# Altium schematic sheet 锐米 LoRaWAN Gateway 原理图.SchDoc
size A2
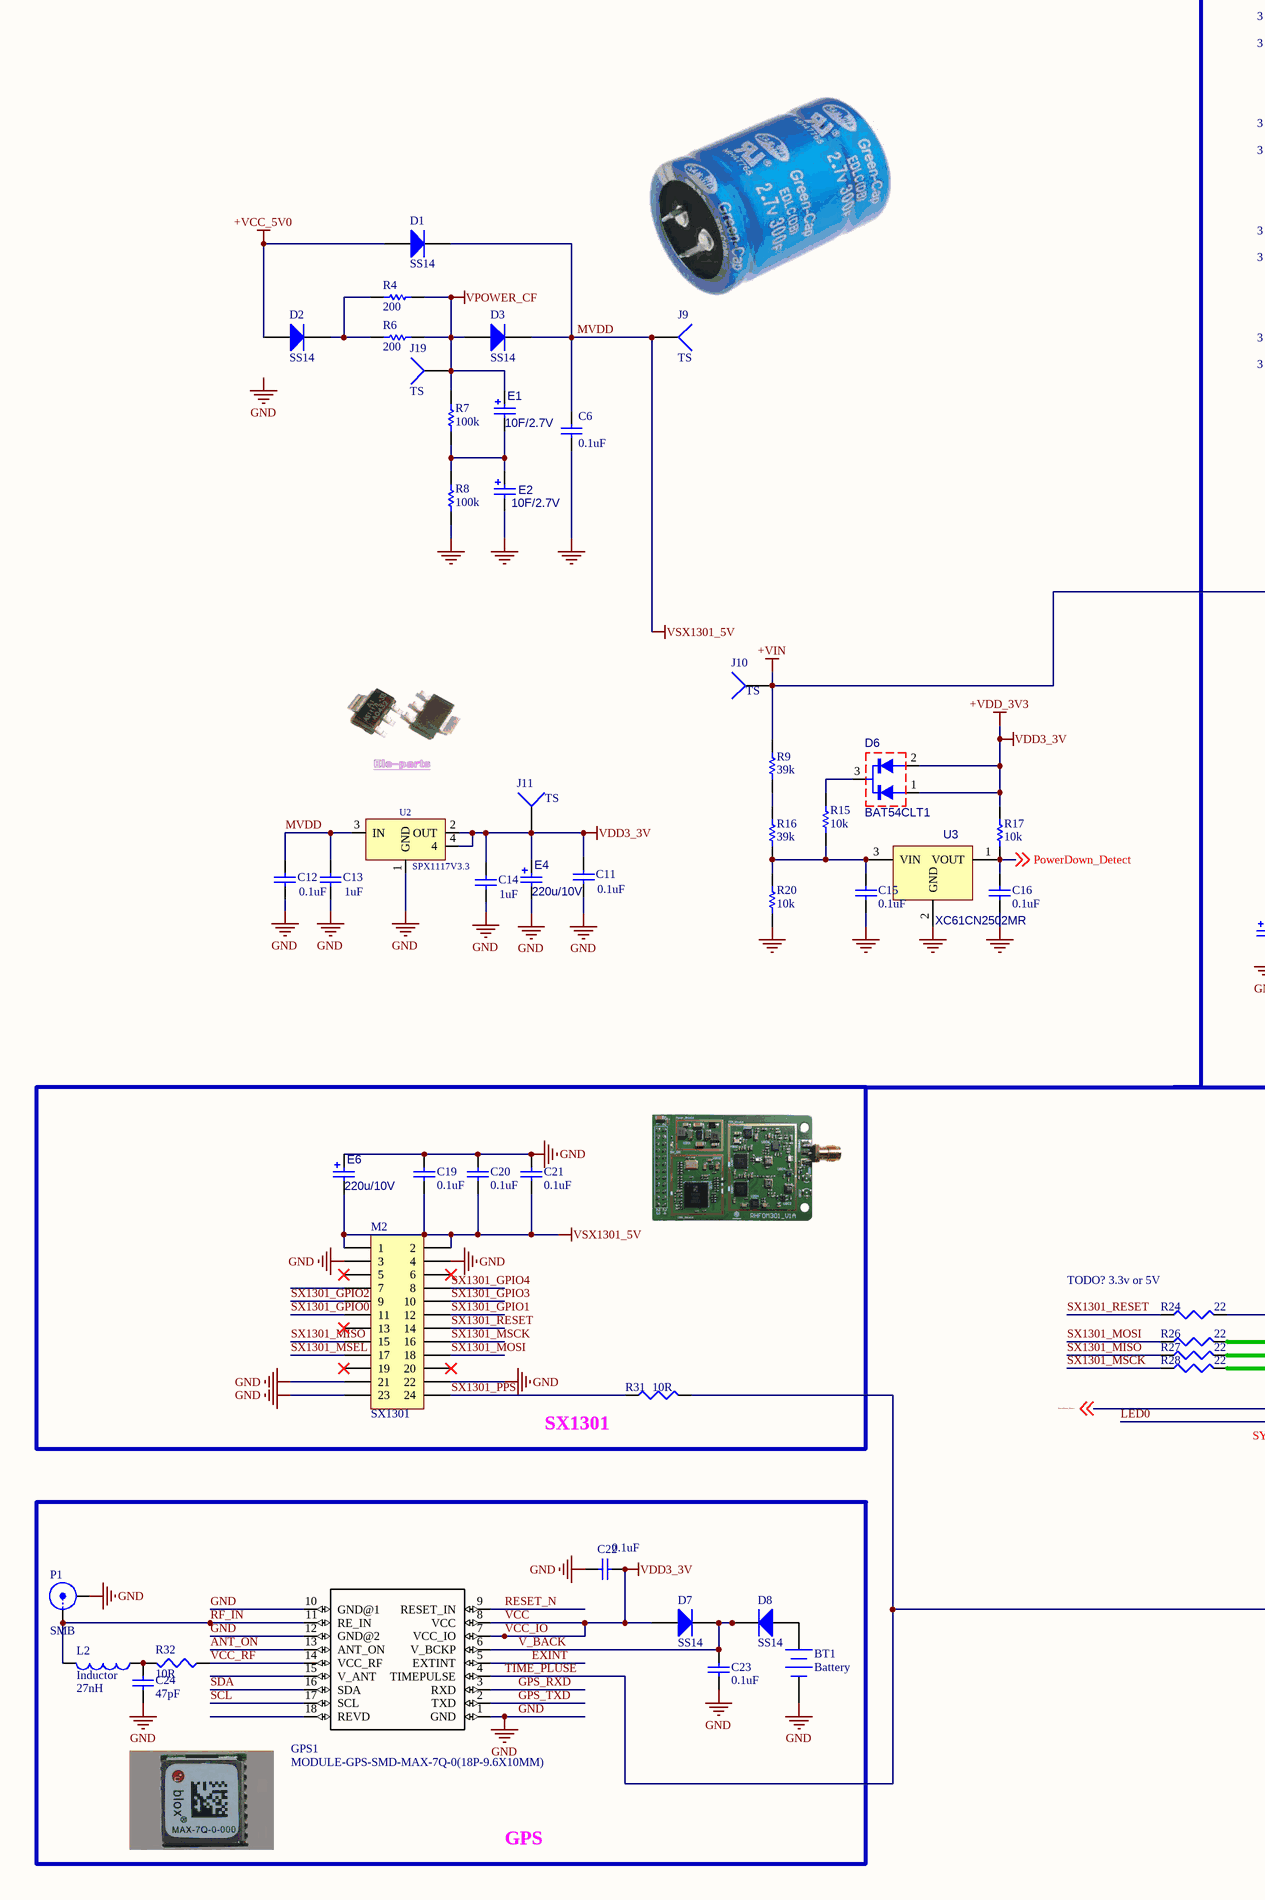
[diagram p0: 锐米 LoRaWAN Gateway 原理图.SchDoc, left]
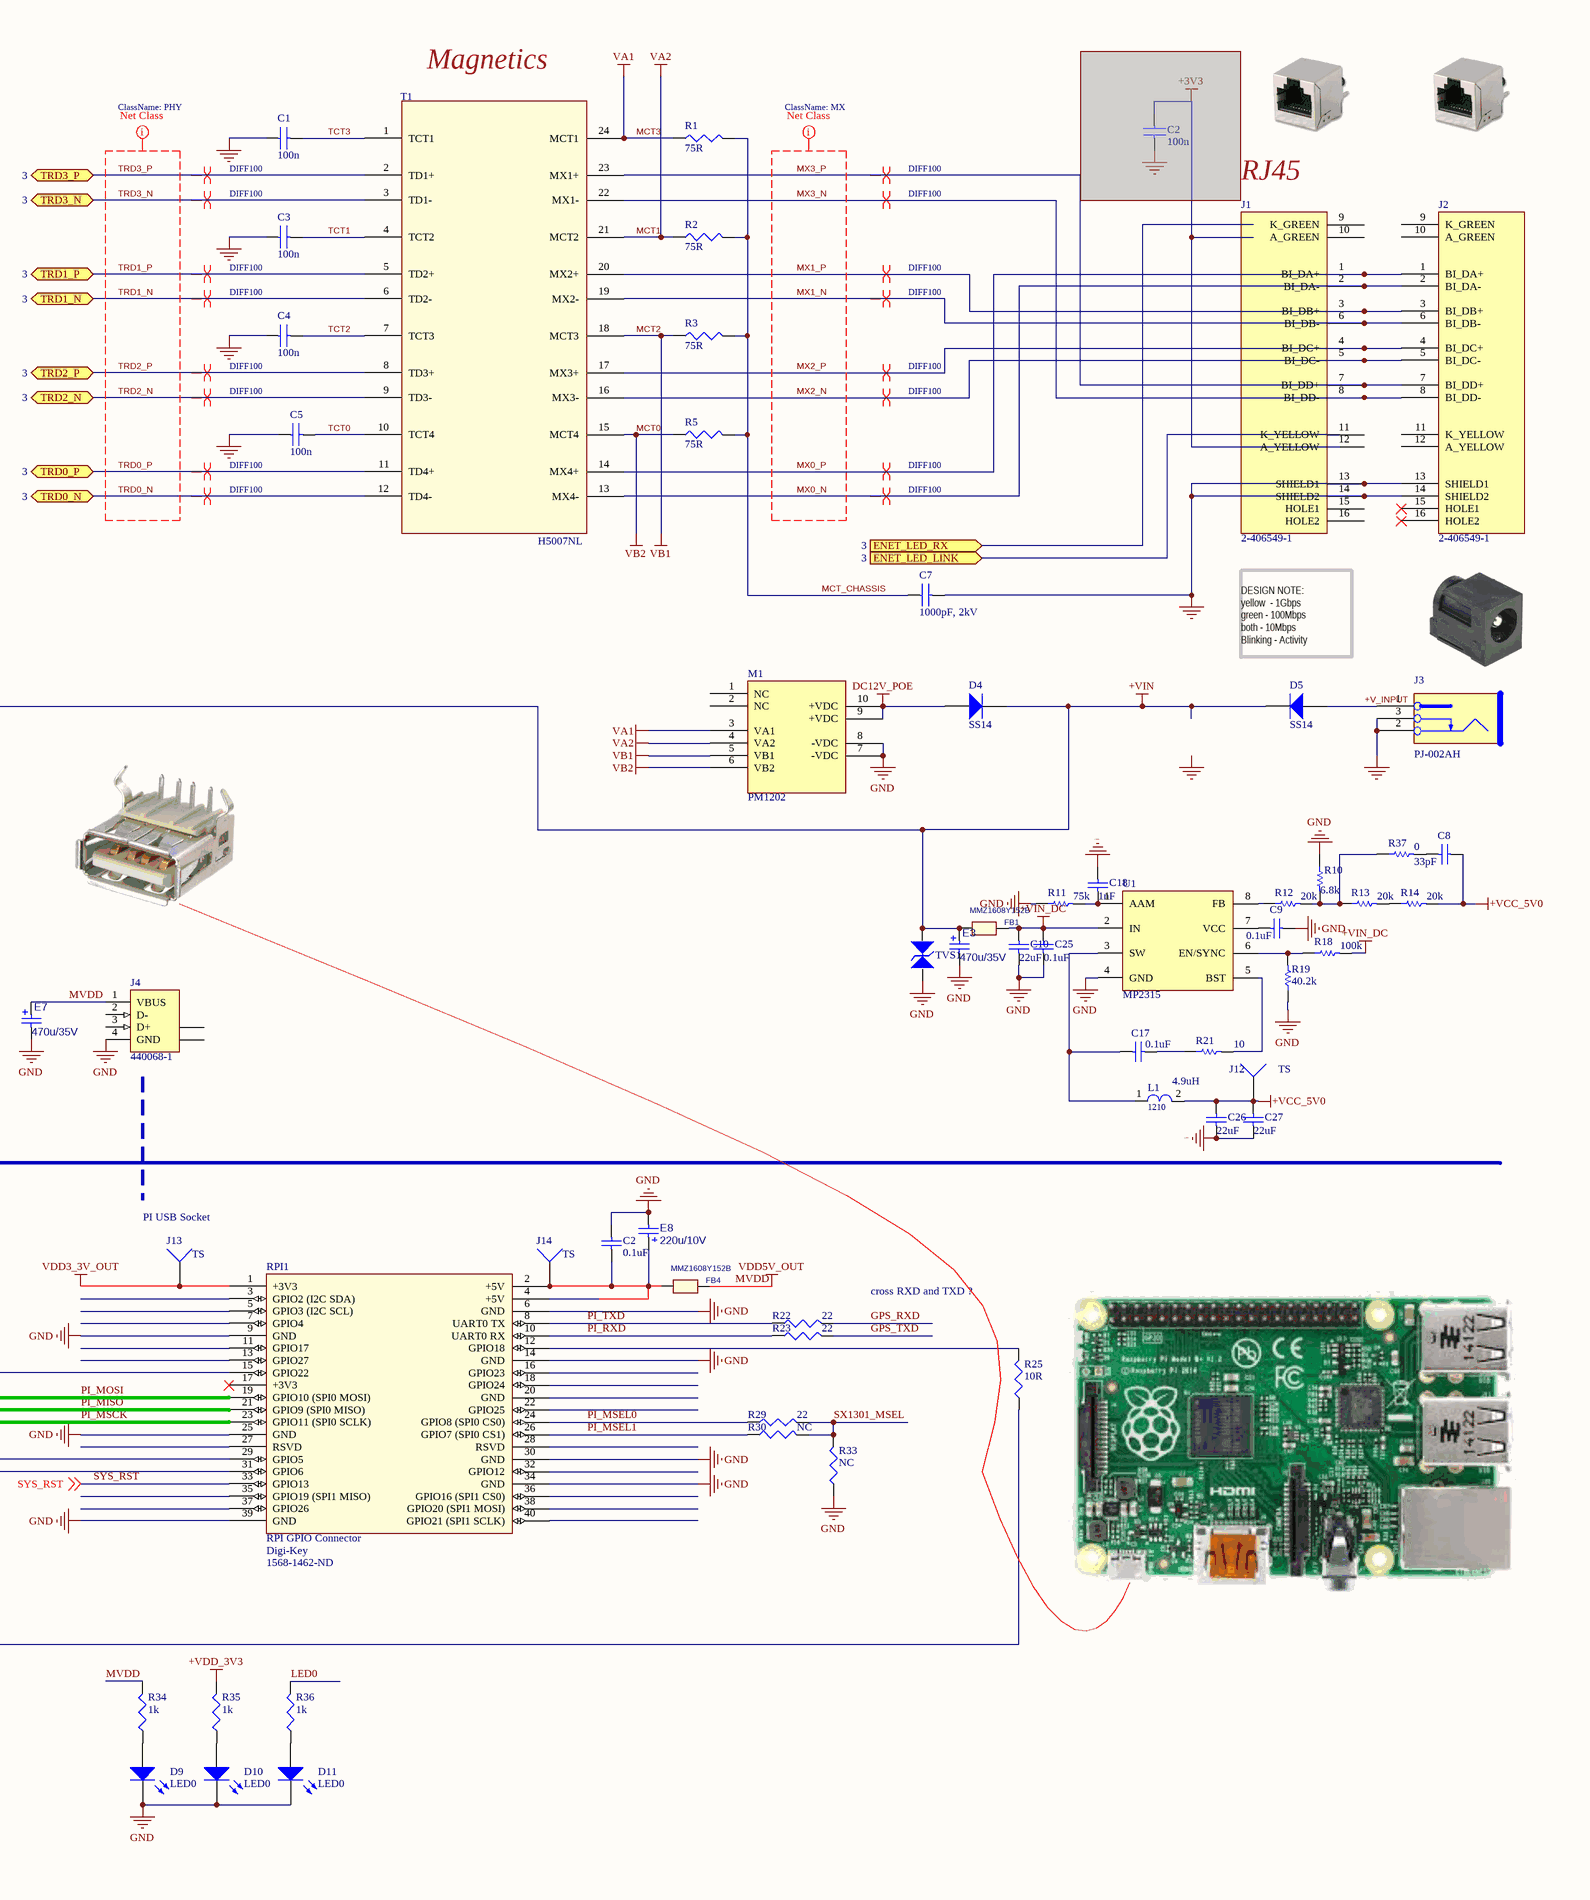
[diagram p1: 锐米 LoRaWAN Gateway 原理图.SchDoc, right]

## Parts
(Parts that share a designator on the sheet are numbered #1, #2 ... from top to bottom, then left to right.)
BT1  Battery  [BAT12X25]
C1  100n  [0603_C]
C2#1  100n  [C0603]  (masked out: inside a compile mask, not in the netlist)
C2#2  value 0.1uF  [0603_C]  (hidden comment: Cap)
C3  100n  [0603_C]
C4  100n  [0603_C]
C5  100n  [0603_C]
C6  0.1uF  [0603_C]
C7  1000pF, 2kV  [C1206]
C8  value 33pF  [0603_C]  (hidden comment: Cap)
C9  value 0.1uF  [0603_C]  (hidden comment: Cap)
C10  22uF  [3225[1210]]
C11  0.1uF  [0603_C]
C12  0.1uF  [0603_C]
C13  1uF  [0603_C]
C14  1uF  [0603_C]
C15  value 0.1uF  [0603_C]  (hidden comment: Cap)
C16  value 0.1uF  [0603_C]  (hidden comment: Cap)
C17  value 0.1uF  [0603_C]  (hidden comment: Cap)
C18  1nF  [0603_C]
C19  value 0.1uF  [0603_C]  (hidden comment: Cap Semi)
C20  value 0.1uF  [0603_C]  (hidden comment: Cap Semi)
C21  value 0.1uF  [0603_C]  (hidden comment: Cap Semi)
C22  value 0.1uF  [0603_C]  (hidden comment: Cap Semi)
C23  value 0.1uF  [0603_C]  (hidden comment: Cap Semi)
C24  value 47pF  [0603_C]  (hidden comment: Cap Semi)
C25  0.1uF  [0603_C]
C26  22uF  [3225[1210]]
C27  22uF  [3225[1210]]
D1  SS14  [DIO-2]
D2  SS14  [DIO-2]
D3  SS14  [DIO-2]
D4  SS14  [DIO-2]
D5  SS14  [DIO-2]
D6  BAT54CLT1  [SOT-23]
D7  SS14  [DIO-2]
D8  SS14  [DIO-2]
D9  LED0  [0805_LED12]
D10  LED0  [0805_LED12]
D11  LED0  [0805_LED12]
E1  10F/2.7V  [FL]
E2  10F/2.7V  [FL]
E3  470u/35V  [HC10X14]
E4  220u/10V  [HC6X10]
E6  220u/10V  [HC6X10]
E7  470u/35V  [HC10X14]
E8  220u/10V  [HC6X10]
FB1  MMZ1608Y152B  [0603_R]
FB4  MMZ1608Y152B  [0603_R]
GPS1  MODULE-GPS-SMD-MAX-7Q-0(18P-9.6X10MM)  [GPS18P-SMD-1.1-10X9.6MM]
J1  2-406549-1  [RJ45LED]
J2  2-406549-1  [RJ45LED]
J3  PJ-002AH  [POWER_JACK_5.5_2.1MM_NS]
J4  440068-1  [440068]
J9  TS  [TP1_COVER]
J10  TS  [TP1_COVER]
J11  TS  [TP1_COVER]
J12  TS  [TP1_COVER]
J13  TS  [TP1_COVER]
J14  TS  [TP1_COVER]
J19  TS  [TP1_COVER]
L1  4.9uH  BOM_PACKAGE: 1210  [INDP7172X50N]
L2  Inductor  value 27nH  [0603_C]
M1  PM1202  [PM1202]
M2  SX1301  [SX1301]
P1  SMB  [U.FL-R-SMT HIROSE]
R1  75R  [0603_R]
R2  75R  [0603_R]
R3  75R  [0603_R]
R4  value 200  [1206]  (hidden comment: 10k)
R5  75R  [0603_R]
R6  value 200  [1206]  (hidden comment: 10k)
R7  value 100k  [1206]  (hidden comment: 10k)
R8  value 100k  [1206]  (hidden comment: 10k)
R9  39k  [0603_R]
R10  6.8k  [0603_R]
R11  75k  [0603_R]
R12  20k  [0603_R]
R13  20k  [0603_R]
R14  20k  [0603_R]
R15  10k  [0603_R]
R16  39k  [0603_R]
R17  10k  [0603_R]
R18  100k  [0603_R]
R19  40.2k  [0603_R]
R20  10k  [0603_R]
R21  10  [0603_R]
R22  22  [0603_R]
R23  22  [0603_R]
R24  22  [0603_R]
R25  10R  [0603_R]
R26  22  [0603_R]
R27  22  [0603_R]
R28  22  [0603_R]
R29  22  [0603_R]
R30  NC  [0603_R]
R31  10R  [0603_R]
R32  10R  [0603_R]
R33  NC  [0603_R]
R34  1k  [0603_R]
R35  1k  [0603_R]
R36  1k  [0603_R]
R37  0  [0603_R]
RPI1  RPI GPIO Connector  Supplier 1: Digi-Key  Supplier Part Number 1: 1568-1462-ND  [PI_3]
T1  H5007NL  [H5007NL]
TVS1  (no value)  [TVS-1]
U1  MP2315  [TSOT23-8]
U2  SPX1117V3.3  [SOT223_N]
U3  XC61CN2502MR  [SOT-23]

## Blocks framed on the sheet
SX1301: C19-C21 E6 M2 R31
GPS: BT1 C22-C24 D7 D8 GPS1 L2 P1 R32

## Ports
ENET_LED_LINK (in, see 3), ENET_LED_RX (in, see 3), TRD0_N (bidir, see 3), TRD0_P (bidir, see 3), TRD1_N (bidir, see 3), TRD1_P (bidir, see 3), TRD2_N (bidir, see 3), TRD2_P (bidir, see 3), TRD3_N (bidir, see 3), TRD3_P (bidir, see 3)

## Nets
+VCC_5V0: C8.2 C26.2 C27.2 D1.A D2.A J12.1 L1.2 R14.2
+VIN: D4.K D5.K E3.1 FB1.1 J10.1 R9.1 TVS1.2
+VIN_DC: C10.2 C25.2 FB1.2 R18.2 U1.2(IN)
DC12V_POE: D4.A M1.9(+VDC) M1.10(+VDC)
GND: BT1.2(-) C1.1 C2#2.1 C3.1 C4.1 C5.1 C6.2 C7.2 C9.2 C10.1 C11.2 C12.2 C13.2 C14.2 C15.2 C16.2 C18.2 C19.1 C20.1 C21.1 C22.1 C23.1 C24.2 C25.1 C26.1 C27.1 D9.2(K) D10.2(K) D11.2(K) E2.2 E3.2 E4.2 E6.1 E7.2 E8.2 GPS1.1(GND) GPS1.10(GND@1) GPS1.12(GND@2) J1.13(SHIELD1) J1.14(SHIELD2) J2.13(SHIELD1) J2.14(SHIELD2) J3.2 J3.3 J4.4(GND) M1.7(-VDC) M1.8(-VDC) M2.3 M2.4 M2.21 M2.22 M2.23 P1.2(Y) R8.2 R10.1 R11.1 R19.1 R20.2 R33.1 RPI1.6(GND) RPI1.9(GND) RPI1.14(GND) RPI1.25(GND) RPI1.30(GND) RPI1.34(GND) RPI1.39(GND) TVS1.1 U1.4(GND) U2.1(GND) U3.2(GND)
MCT0: M1.6(VB2) R5.1 T1.15(MCT4)  [also labelled VB2]
MCT1: M1.4(VA2) R2.1 T1.21(MCT2)  [also labelled VA2]
MCT2: M1.5(VB1) R3.1 T1.18(MCT3)  [also labelled VB1]
MCT3: M1.3(VA1) R1.1 T1.24(MCT1)  [also labelled VA1]
MVDD: C6.1 C12.1 C13.1 C19.2 C20.2 C21.2 D1.K D3.K E6.2 E7.1 FB4.2 J4.1(VBUS) J9.1 M2.1 M2.2 R34.2 U2.3(IN)  [also labelled VDD5V_OUT, VSX1301_5V]
VCC: C11.1 C14.1 C22.2 D6.1 D6.2 D7.A E4.1 GPS1.7(VCC_IO) GPS1.8(VCC) J11.1 R17.1 R35.2 U2.2(OUT) U2.4  [also labelled +VDD_3V3, VCC_IO, VDD3_3V]
VDD3_3V_OUT: J13.1 RPI1.1(+3V3)
VPOWER_CF: D3.A E1.1 J19.1 R4.1 R6.1 R7.1
+V_INPUT: D5.A J3.1
ANT_ON: GPS1.13(ANT_ON)
EXINT: GPS1.5(EXTINT)
GPS_RXD: GPS1.3(RXD) R22.2
GPS_TXD: GPS1.2(TXD) R23.2
LED0: R36.2 RPI1.31(GPIO6)
MCT_CHASSIS: C7.1 R1.2 R2.2 R3.2 R5.2
MX0_N: J1.2(BI_DA-) J2.2(BI_DA-) T1.13(MX4-)
MX0_P: J1.1(BI_DA+) J2.1(BI_DA+) T1.14(MX4+)
MX1_N: J1.6(BI_DB-) J2.6(BI_DB-) T1.19(MX2-)
MX1_P: J1.3(BI_DB+) J2.3(BI_DB+) T1.20(MX2+)
MX2_N: J1.5(BI_DC-) J2.5(BI_DC-) T1.16(MX3-)
MX2_P: J1.4(BI_DC+) J2.4(BI_DC+) T1.17(MX3+)
MX3_N: J1.8(BI_DD-) J2.8(BI_DD-) T1.22(MX1-)
MX3_P: J1.7(BI_DD+) J2.7(BI_DD+) T1.23(MX1+)
PI_MISO: R27.2 RPI1.21(GPIO9_(SPI0_MISO))
PI_MOSI: R26.2 RPI1.19(GPIO10_(SPI0_MOSI))
PI_MSCK: R28.2 RPI1.23(GPIO11_(SPI0_SCLK))
PI_MSEL0: R29.1 RPI1.24(GPIO8_(SPI0_CS0))
PI_MSEL1: R30.1 RPI1.26(GPIO7_(SPI0_CS1))
PI_RXD: R23.1 RPI1.10(UART0_RX)
PI_TXD: R22.1 RPI1.8(UART0_TX)
PowerDown_Detect: C16.1 R17.2 RPI1.29(GPIO5) U3.1(VOUT) ; off-sheet PowerDown_Detect
RESET_N: GPS1.9(RESET_IN)
RF_IN: GPS1.11(RE_IN) L2.1 P1.1(X)
SCL: GPS1.17(SCL)
SDA: GPS1.16(SDA)
SX1301_GPIO0: M2.11
SX1301_GPIO1: M2.12
SX1301_GPIO2: M2.9
SX1301_GPIO3: M2.10
SX1301_GPIO4: M2.8
SX1301_MISO: M2.15 R27.1
SX1301_MOSI: M2.18 R26.1
SX1301_MSCK: M2.16 R28.1
SX1301_MSEL: M2.17 R29.2 R30.2 R33.2
SX1301_PPS: M2.24 R31.1
SX1301_RESET: M2.14 R24.1
SYS_RST: RPI1.33(GPIO13) ; off-sheet SYS_RST
TCT0: C5.2 T1.10(TCT4)
TCT1: C3.2 T1.4(TCT2)
TCT2: C4.2 T1.7(TCT3)
TCT3: C1.2 T1.1(TCT1)
TIME_PLUSE: GPS1.4(TIMEPULSE) R25.1 R31.2
TRD0_N: T1.12(TD4-) ; port TRD0_N
TRD0_P: T1.11(TD4+) ; port TRD0_P
TRD1_N: T1.6(TD2-) ; port TRD1_N
TRD1_P: T1.5(TD2+) ; port TRD1_P
TRD2_N: T1.9(TD3-) ; port TRD2_N
TRD2_P: T1.8(TD3+) ; port TRD2_P
TRD3_N: T1.3(TD1-) ; port TRD3_N
TRD3_P: T1.2(TD1+) ; port TRD3_P
V_BACK: C23.2 D7.K D8.K GPS1.6(V_BCKP)
VCC_RF: GPS1.14(VCC_RF) R32.2
NetBT1_1: BT1.1(+) D8.A
NetC2#2_2: C2#2.2 E8.1 FB4.1 J14.1 RPI1.2(+5V) RPI1.4(+5V)
NetC8_1: C8.1 R37.2
NetC9_1: C9.1 U1.7(VCC)
NetC15_1: C15.1 R15.2 R16.2 R20.1 U3.3(VIN)
NetC17_1: C17.1 L1.1 U1.3(SW)
NetC17_2: C17.2 R21.1
NetC18_1: C18.1 R11.2 U1.1(AAM)
NetC24_1: C24.1 L2.2 R32.1
NetD2_K: D2.K R4.2 R6.2
NetD6_3: D6.3 R15.1
NetD9_1: D9.1(A) R34.1
NetD10_1: D10.1(A) R35.1
NetD11_1: D11.1(A) R36.1
NetE1_2: E1.2 E2.1 R7.2 R8.1
NetR9_2: R9.2 R16.1
NetR10_2: R10.2 R12.2 R13.1 R37.1
NetR12_1: R12.1 U1.8(FB)
NetR13_2: R13.2 R14.1
NetR18_1: R18.1 R19.2 U1.6(EN/SYNC)
NetR21_2: R21.2 U1.5(BST)
NetR24_2: R24.2 RPI1.15(GPIO22)
NetR25_2: R25.2 RPI1.12(GPIO18)

Not connected (* = marked no-connect by the designer): GPS1 15(V_ANT) 18(REVD); J1 9(K_GREEN) 10(A_GREEN) 11(K_YELLOW) 12(A_YELLOW) 15(HOLE1) 16(HOLE2); J2 9(K_GREEN) 10(A_GREEN) 11(K_YELLOW) 12(A_YELLOW) 15(HOLE1)* 16(HOLE2)*; J4 2(D-) 3(D+) 5(SHLD) 6(SHLD); M1 1(NC) 2(NC); M2 5* 6* 7 13* 19* 20*; RPI1 3(GPIO2_(I2C_SDA)) 5(GPIO3_(I2C_SCL)) 7(GPIO4) 11(GPIO17) 13(GPIO27) 16(GPIO23) 17(+3V3)* 18(GPIO24) 20(GND) 22(GPIO25) 27(RSVD) 28(RSVD) 32(GPIO12) 35(GPIO19_(SPI1_MISO)) 36(GPIO16_(SPI1_CS0)) 37(GPIO26) 38(GPIO20_(SPI1_MOSI)) 40(GPIO21_(SPI1_SCLK))

## Layout directives
differential pair; net class DIFF100: MX0_N, MX0_P, MX1_N, MX1_P, MX2_N, MX2_P, MX3_N, MX3_P, TRD0_N, TRD0_P, TRD1_N, TRD1_P, TRD2_N, TRD2_P, TRD3_N, TRD3_P
net class PHY: TRD0_N, TRD0_P, TRD1_N, TRD1_P, TRD2_N, TRD2_P, TRD3_N, TRD3_P
net class MX: MX0_N, MX0_P, MX1_N, MX1_P, MX2_N, MX2_P, MX3_N, MX3_P

## Notes on the sheet
- Magnetics
- (near J1) RJ45
- DESIGN NOTE:
  yellow  - 1Gbps
  green - 100Mbps
  both - 10Mbps
  Blinking - Activity
- (near J13) PI USB Socket
- (near R24) TODO? 3.3v or 5V
- cross RXD and TXD ?
- Labels drawn without touching a wire or pin: GND

## Library data of the parts
BT1 = Battery: Multicell Battery; Published: 24-Mar-1999; LatestRevisionDate: 17-Jul-2002; LatestRevisionNote: Re-released for DXP Platform.; PackageReference: BAT-2; Publisher: Altium Limited; PackageDescription: Battery; 2 Leads
C1 C2#1 C3-C5 = C1005X5R1H104K: CAP CER .10UF 50V X5R 10% 0402; Manufacturer: TDK Corporation; Capacitance: 0.1礔; Value: 100nF; .Checked PCB: used; Tolerance: ?0%; Category: Capacitors; Supplier Part Number: 445-5942-1-ND; Manufacturer Part Number: C1005X5R1H104K; Operating Temperature: -55癈 ~ 85癈; Package / Case: 0402 (1005 Metric); Price 1k [$]: 0.02340; .Checked SCH: used; Voltage - Rated: 50V; Supplier: Digikey; Supplier 1: Digi-Key; Supplier Part Number 1: 445-5942-1-ND; RoHS: RoHS Compliant; Stock 1: 106926; Pricing 1: 1=0.27, 10=0.18, 100=0.072, 250=0.05176, 500=0.0369, 1000=0.027 (USD); Temperature Coefficient: X5R; Mounting Type: Surface Mount, MLCC; Applications: General Purpose; Ratings: -; Size / Dimension: 0.039" L x 0.020" W (1.00mm x 0.50mm); Height - Seated (Max): -; Thickness (Max): 0.022" (0.55mm); Lead Spacing: -; Features: -; Packaging: Cut Tape (CT); Lead Style: -; ComponentLink1URL: http://www.tdk.co.jp/tefe02/e412_c.pdf; ComponentLink1Description: http://www.tdk.co.jp/tefe02/e412_c.pdf
C2#2 C8 C9 C14-C17 = Cap: Capacitor; Published: 8-Jun-2000; LatestRevisionDate: 17-Jul-2002; LatestRevisionNote: Re-released for DXP Platform.; PackageReference: RAD-0.3; Publisher: Altium Limited; PackageDescription: Radial Cap, Thru-Hole; 2 Leads; 0.3 in Pin Spacing
  C14: Value: 1uF
C6 C11 C12 = Cap: Capacitor; Value: 0.1; Published: 8-Jun-2000; LatestRevisionDate: 17-Jul-2002; LatestRevisionNote: Re-released for DXP Platform.; PackageReference: RAD-0.3; Publisher: Altium Limited; PackageDescription: Radial Cap, Thru-Hole; 2 Leads; 0.3 in Pin Spacing
C7 = C1206X102KGRACTU: CAP CER 1000PF 2000V X7R 1206 FT; Manufacturer: Kemet; .Checked PCB: used; Voltage - Rated: 2000V (2kV); Tolerance: ?0%; Capacitance: 1000pF; Category: Capacitors; Supplier Part Number: 399-5830-1-ND; Manufacturer Part Number: C1206X102KGRACTU; Operating Temperature: -55癈 ~ 125癈; Package / Case: 1206 (3216 Metric); Price 1k [$]: 0.27600; Value: 1000pF, 2kV; .Checked SCH: used; Supplier: Digikey; Supplier 1: Digi-Key; Supplier Part Number 1: 399-5830-1-ND; RoHS: RoHS Compliant; Stock 1: 2068; Pricing 1: 1=0.92, 10=0.771, 25=0.6324, 100=0.483, 250=0.37952, 500=0.345, 1000=0.276 (USD); Temperature Coefficient: X7R; Mounting Type: Surface Mount, MLCC; Applications: Boardflex Sensitive; Ratings: -; Size / Dimension: 0.134" L x 0.063" W (3.40mm x 1.60mm); Height - Seated (Max): -; Thickness (Max): 0.069" (1.75mm); Lead Spacing: -; Features: Soft Termination, High Voltage; Packaging: Cut Tape (CT); Lead Style: -; ComponentLink1URL: http://www.kemet.com/kemet/web/homepage/kechome.nsf/weben/8311688D32A99EF8852578B500644843/$file/KEM_CC105_HIVOLT.pdf; ComponentLink1Description: http://www.kemet.com/kemet/web/homepage/kechome.nsf/weben/8311688D32A99EF8852578B500644843/$file/KEM_CC105_HIVOLT.pdf
C10 C18 C25-C27 = Cap: Capacitor; Value: 4.7uF; Published: 8-Jun-2000; LatestRevisionDate: 17-Jul-2002; LatestRevisionNote: Re-released for DXP Platform.; PackageReference: RAD-0.3; Publisher: Altium Limited; PackageDescription: Radial Cap, Thru-Hole; 2 Leads; 0.3 in Pin Spacing
C13 = Cap: Capacitor; Value: 1u; Published: 8-Jun-2000; LatestRevisionDate: 17-Jul-2002; LatestRevisionNote: Re-released for DXP Platform.; PackageReference: RAD-0.3; Publisher: Altium Limited; PackageDescription: Radial Cap, Thru-Hole; 2 Leads; 0.3 in Pin Spacing
C19-C24 = Cap Semi: Capacitor (Semiconductor SIM Model); Published: 8-Jun-2000; LatestRevisionDate: 05-oct-2007  -  Semtech; LatestRevisionNote: Re-released for DXP Platform.; Publisher: Altium Limited
D1-D5 D7 D8 = Diode: Default Diode; Published: 8-Jun-2000; LatestRevisionDate: 17-Jul-2002; LatestRevisionNote: Re-released for DXP Platform.; PackageVersion: Sep-1996; PackageReference: SMC; Publisher: Altium Limited; Code_JEDEC: DO-214-AB
D6 = DIODE-2
D9-D11 = LED0: Typical INFRARED GaAs LED; Published: 8-Jun-2000; LatestRevisionDate: 08-Jul-2005; LatestRevisionNote: Mech Layer 1 removed.; PackageReference: LED-0; Publisher: Altium Limited; PackageDescription: LED; 2 Leads
E1-E4 E6-E8 = Cap Pol1: Polarized Capacitor (Radial); Published: *; Publisher: *; Manufacturer: *; Class: *; SubClass: *
FB1 FB4 = BEAD FERRITE/SM: BOM_Package: 0603; BOM_Name: FERRITE CHIP 1500 OHM 300MA 0603; BOM_Vendor: 445-1553-1-ND; COMPSIDE: TOP; COMPLOC: [790.000,1085.000]; COMPROT: 270; COMPGROUP: 0; COMPFIXED: NO; COMPHEIGHT: 0.000; BOM_ROHS: Lead-free; BOM_manufacturerPN: MMZ1608Y152B; COMPLOCKED: NO; COMPKEY: NO; DECOUPLER: NO; MEMORY: NO
GPS1 = MODULE-GPS-SMD-MAX-7Q-0(18P-9.6X10MM): SMD GPS Module%3B; MF: u-blox; Availability: Unavailable; Package: None; MP: MAX-7Q-0; Price: 12.00 USD; Value: *
J1 J2 = 2-406549-1: CONN MOD JACK 8POS R/A G-Y PCB; Manufacturer: Tyco; .Checked PCB: used; Number of Positions: 8p8c (RJ45, Ethernet); Number of Ports: 1; Shielding: Shielded, EMI Finger; Ratings: Cat5; LED Color: Yellow - Green; Tab Direction: Up; .Checked SCH: used; Category: Connectors, Interconnects; Connector Type: Jack; Manufacturer Part Number: 2-406549-1; Price 1k [$]: 1.73278; Supplier: Digikey; Supplier Part Number: A97715-ND; Value: 2-406549-1; Supplier 1: Digi-Key; Supplier Part Number 1: A97715-ND; RoHS: RoHS Compliant; Stock 1: 9021; Pricing 1: 1=3.42 (USD); Number of Positions/Contacts: 8p8c (RJ45, Ethernet); Number of Rows: 1; Mounting Type: Through Hole; Orientation: 90?Angle (Right); Termination: Solder; Features: Board Lock; Packaging: Tray; Housing Material: Thermoplastic; Contact Material: Phosphor Bronze; Contact Finish: Gold; Operating Temperature: -40癈 ~ 85癈; ComponentLink1URL: http://documents.tycoelectronics.com/commerce/DocumentDelivery/DDEController?Action=srchrtrv&DocNm=406549&DocType=CD&DocLang=EN; ComponentLink1Description: http://documents.tycoelectronics.com/commerce/DocumentDelivery/DDEController?Action=srchrtrv&DocNm=406549&DocType=CD&DocLang=EN
J3 = PJ-002AH: CONN PWR JACK 2.1X5.5MM HIGH CUR; Manufacturer: CUI Inc; .Checked PCB: used; Mating connector: 2.1mm ID, 5.5mm OD; Gender: Male; Number of Positions/Contacts: 2 Conductors, 3 Contacts; Internal Switch(s): Single Switch, Normally Closed; Shielding: Unshielded; Voltage - Rated: 24VDC; Current Rating: 5A; .Checked SCH: used; Category: Connectors, Interconnects; Family: Barrel - Power; Manufacturer Part Number: PJ-002AH; Operating Temperature: -25癈 ~ 85癈; Price 1k [$]: 0.23625; Supplier: Digikey; Supplier Part Number: CP-002AH-ND; Value: PJ-002AH; Supplier 1: Digi-Key; Supplier Part Number 1: CP-002AH-ND; RoHS: RoHS Compliant; Stock 1: 138933; Pricing 1: 1=1.01, 10=0.704, 100=0.4724, 500=0.3819, 1000=0.3417, 2500=0.27135 (USD); Connector Type: Jack; Plug/Mating Plug Diameter: 2.1mm ID, 5.5mm OD; Mounting Type: Through Hole, Right Angle; Termination: Solder Eyelet(s); Features: -; Color: Black; Contact Material: Copper Alloy; Contact Material - Plating: Nickel; Housing Color: Black; Housing Material: Thermoplastic; ComponentLink1URL: http://products.cui.com/GetSpecForDigiKey.aspx?MFGNum=PJ-002AH; ComponentLink1Description: http://products.cui.com/GetSpecForDigiKey.aspx?MFGNum=PJ-002AH
J4 = 440068-1: USB 1.1, Right Angle, Thru-Hole, Reverse Type, Receptacle, 4 Position, Black; ContactMaterial: Copper Alloy; ContactPlating: Gold Flash; TerminationLength: 2.40mm [0.094in.]; PCB_Layout: Complies with manufacturer's recommendation.; DrillSize: Corresponds to nominal value.; PanelGround: Without; Published: 15-Jul-2004; DatasheetDocument: 18-Mar-2004; PackageDocument: 18-Mar-2004; PackageReference: 440068; Publisher: Altium Limited; HousingMaterial: Glass-Filled Thermoplastic; ComponentLink1Description: Manufacturer Link; ComponentLink1URL: http://www.tycoelectronics.com/; ComponentLink2Description: Packaging Specification; ComponentLink2URL: http://ecommas.tycoelectronics.com/commerce/DocumentDelivery/DDEController?Action=showdoc&DocId=Customer+Drawing%7F440068%7FD%7Ftif%7FEnglish%7FC_440068_D.tif
J9-J14 J19 = Socket: LatestRevisionDate: 17-Jul-2002; LatestRevisionNote: Re-released for DXP Platform.; Publisher: Altium Limited
L1 = Inductor 10uH SMD 1210: BOM_DESCRIPTION: VEFW3225-100K SMD 10uH ±10% 氧化铁 -深圳千代源; BOM_MFG_PN: NRS6045T680MMGK; BOM_VENDOR: L21005S0; BOM_VENDOR_PN: 587-2958-1-ND; BOM_NAME: 贴片电感
L2 = Inductor: Code_IEC: 1005; Published: 8-Jun-2000; LatestRevisionDate: 29-May-2009; LatestRevisionNote: IPC-7351 Footprint Added.; PackageReference: 0402-A; Publisher: Altium Limited; PackageDescription: Chip Inductor; Code_JEITA: 0402
M2 = Header 12X2: Header, 12-Pin, Dual row; LatestRevisionDate: 17-Jul-2002; LatestRevisionNote: Re-released for DXP Platform.; Publisher: Altium Limited
P1 = SMB: SMB Straight Connector; LatestRevisionDate: 17-Jul-2002; LatestRevisionNote: Re-released for DXP Platform.; Publisher: Altium Limited
R1-R3 R5 = RC0402FR-0775RL: RES 75.0 OHM 1/16W 1% 0402 SMD; Manufacturer: Yageo; Resistance (Ohms): 75; Power (Watts): 0.063W, 1/16W; Tolerance: ?%; .Checked PCB: used; Temperature Coefficient: ?00ppm/癈; Category: Resistors; Supplier Part Number: 311-75.0LRCT-ND; Manufacturer Part Number: RC0402FR-0775RL; Package / Case: 0402 (1005 Metric); Price 1k [$]: 0.00288; Value: 75R; .Checked SCH: used; Supplier: Digikey; Supplier 1: Digi-Key; Supplier Part Number 1: 311-75.0LRCT-ND; RoHS: RoHS Compliant; Stock 1: 0; Pricing 1: 10=0.014, 50=0.0104, 100=0.0079, 250=0.00584, 500=0.00432, 1000=0.00288 (USD); Composition: Thick Film; Features: -; Size / Dimension: 0.039" L x 0.020" W (1.00mm x 0.50mm); Height: 0.016" (0.40mm); Number of Terminations: 2; Packaging: Cut Tape (CT); ComponentLink1URL: http://www.yageo.com/documents/recent/PYu-RC0402_51_RoHS_L_6.pdf; ComponentLink1Description: http://www.yageo.com/documents/recent/PYu-RC0402_51_RoHS_L_6.pdf
R4 R6-R21 R37 = Res1: Resistor; Published: 8-Jun-2000; LatestRevisionDate: 17-Jul-2002; LatestRevisionNote: Re-released for DXP Platform.; Publisher: Altium Limited; PackageDescription: Axial Device, Thru-Hole; 2 Leads; 0.3 in Pin Spacing
  R4 R6-R8 R11 R13 R14 R18 R19 R21 R37: PackageReference: AXIAL-0.3
  R9 R16: PackageReference: AXIAL-0.3; Value: 39k
  R10: PackageReference: 0805_R
  R15 R17 R20: PackageReference: AXIAL-0.3; Value: 10k
R22-R36 = RC0402FR-0775RL: RES 75.0 OHM 1/16W 1% 0402 SMD; Manufacturer: Yageo; Resistance (Ohms): 75; Power (Watts): 0.063W, 1/16W; Tolerance: ?%; Value: 75R; .Checked PCB: used; Temperature Coefficient: ?00ppm/癈; Category: Resistors; Supplier Part Number: 311-75.0LRCT-ND; Manufacturer Part Number: RC0402FR-0775RL; Package / Case: 0402 (1005 Metric); Price 1k [$]: 0.00288; .Checked SCH: used; Supplier: Digikey; Supplier 1: Digi-Key; Supplier Part Number 1: 311-75.0LRCT-ND; RoHS: RoHS Compliant; Stock 1: 0; Pricing 1: 10=0.014, 50=0.0104, 100=0.0079, 250=0.00584, 500=0.00432, 1000=0.00288 (USD); Composition: Thick Film; Features: -; Size / Dimension: 0.039" L x 0.020" W (1.00mm x 0.50mm); Height: 0.016" (0.40mm); Number of Terminations: 2; Packaging: Cut Tape (CT); ComponentLink1URL: http://www.yageo.com/documents/recent/PYu-RC0402_51_RoHS_L_6.pdf; ComponentLink1Description: http://www.yageo.com/documents/recent/PYu-RC0402_51_RoHS_L_6.pdf
RPI1 = rpi connector: GPIO Header for Raspberry Pi A+/B+/Pi 2/Pi 3 - 2x20; Manufacturer: SparkFun Electronics; Manufacturer Part Number: PRT-14017; Nils Minor: author; nilsminor@web.de: mail; RoHS: RoHS Compliant; Category: Development Boards, Kits, Programmers; Stock 1: 150; Pricing 1: 1=1.84 (EUR); Part Status: Active; Accessory Type: Connector; For Use With/Related Products: Raspberry Pi; ComponentLink1URL: https://cdn.sparkfun.com/datasheets/Dev/RaspberryPi/12313.pdf; ComponentLink1Description: https://cdn.sparkfun.com/datasheets/Dev/RaspberryPi/12313.pdf
T1 = H5007NL: MODULE SINGLE GIGABIT LAN 24SOIC; Manufacturer: PULSE ELECTRONICS CORPORATION; .Checked PCB: MM; Transformer Type: Isolation and Data Interface (Encapsulated); Turns Ratio - Primary:Secondary: 1CT : 1CT; Category: Transformers; Family: Pulse; Manufacturer Part Number: H5007NL; Operating Temperature: 0癈 ~ 70癈; Price 1k [$]: 3.25125; Supplier: Digikey; Supplier Part Number: 553-1334-ND; .Checked SCH: MM; Supplier 1: Digi-Key; Supplier Part Number 1: 553-1334-ND; RoHS: RoHS Compliant; Stock 1: 15654; Pricing 1: 1=5.74, 10=5.1, 100=4.08, 250=3.69752, 500=3.50626, 1000=3.25125, 5000=3.162 (USD); Inductance: -; E.T.: -; Mounting Type: Surface Mount; Size / Dimension: 17.53mm L x 12.20mm W; Height - Seated (Max): 5.76mm; ComponentLink1URL: http://ww2.pulseeng.com/products/datasheets/HC500.pdf; ComponentLink1Description: http://ww2.pulseeng.com/products/datasheets/HC500.pdf
TVS1 = TVS
U1 = MP2451DT: BOM_MFG_PN: C2012X5R1C106M/1.25; BOM_DESCRIPTION: MP2451DT  SOT-6L  3.3V～36V  600mA -40℃～85℃-MPS; BOM_VENDOR: D2451DTS; BOM_VENDOR_PN: 445-4115-1-ND; BOM_NAME: DC-DC开关电源芯片
U2 = AMS1117 LDO 3.3V 0.8A: BOM_DESCRIPTION: AZ1117H-3.3TRE1 SOT-223 3.3V -40℃～125℃; BOM_VENDOR: N117M33S; BOM_PACKAGE: SOT223; BOM_NAME: LDO(低压差稳压器)
U3 = XC61C/FN